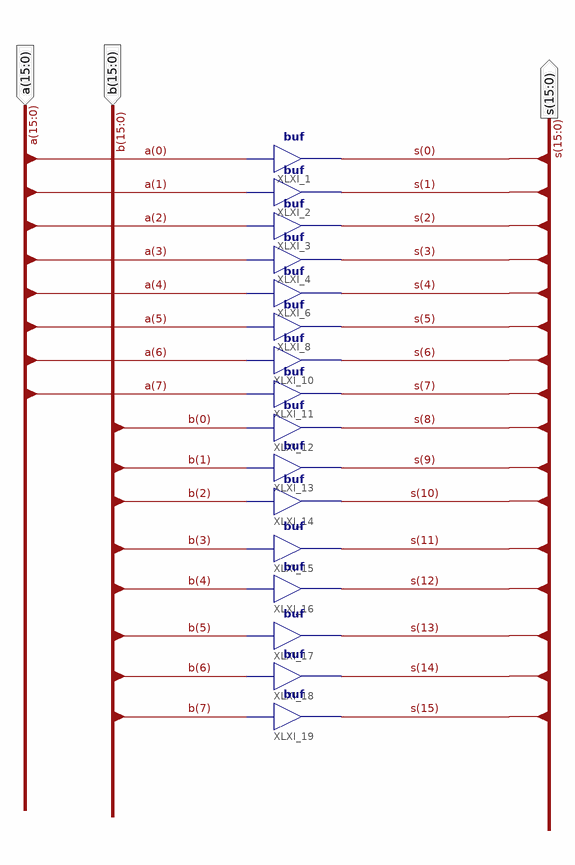
[diagram p0: schematic sheet 1]
// Xilinx ISE schematic concat.sch (spartan3e) as structural Verilog: 16 symbols, 3 ports
module concat (
  input  [15:0] b,
  input  [15:0] a,
  output [15:0] s
);

  buf XLXI_1 (s[0], a[0]);
  buf XLXI_2 (s[1], a[1]);
  buf XLXI_3 (s[2], a[2]);
  buf XLXI_4 (s[3], a[3]);
  buf XLXI_6 (s[4], a[4]);
  buf XLXI_8 (s[5], a[5]);
  buf XLXI_10 (s[6], a[6]);
  buf XLXI_11 (s[7], a[7]);
  buf XLXI_12 (s[8], b[0]);
  buf XLXI_13 (s[9], b[1]);
  buf XLXI_14 (s[10], b[2]);
  buf XLXI_15 (s[11], b[3]);
  buf XLXI_16 (s[12], b[4]);
  buf XLXI_17 (s[13], b[5]);
  buf XLXI_18 (s[14], b[6]);
  buf XLXI_19 (s[15], b[7]);
endmodule
